# Altium schematic sheet 2_Microcontroller.SchDoc
size A4; SheetNumber: 2; SheetTotal: 4
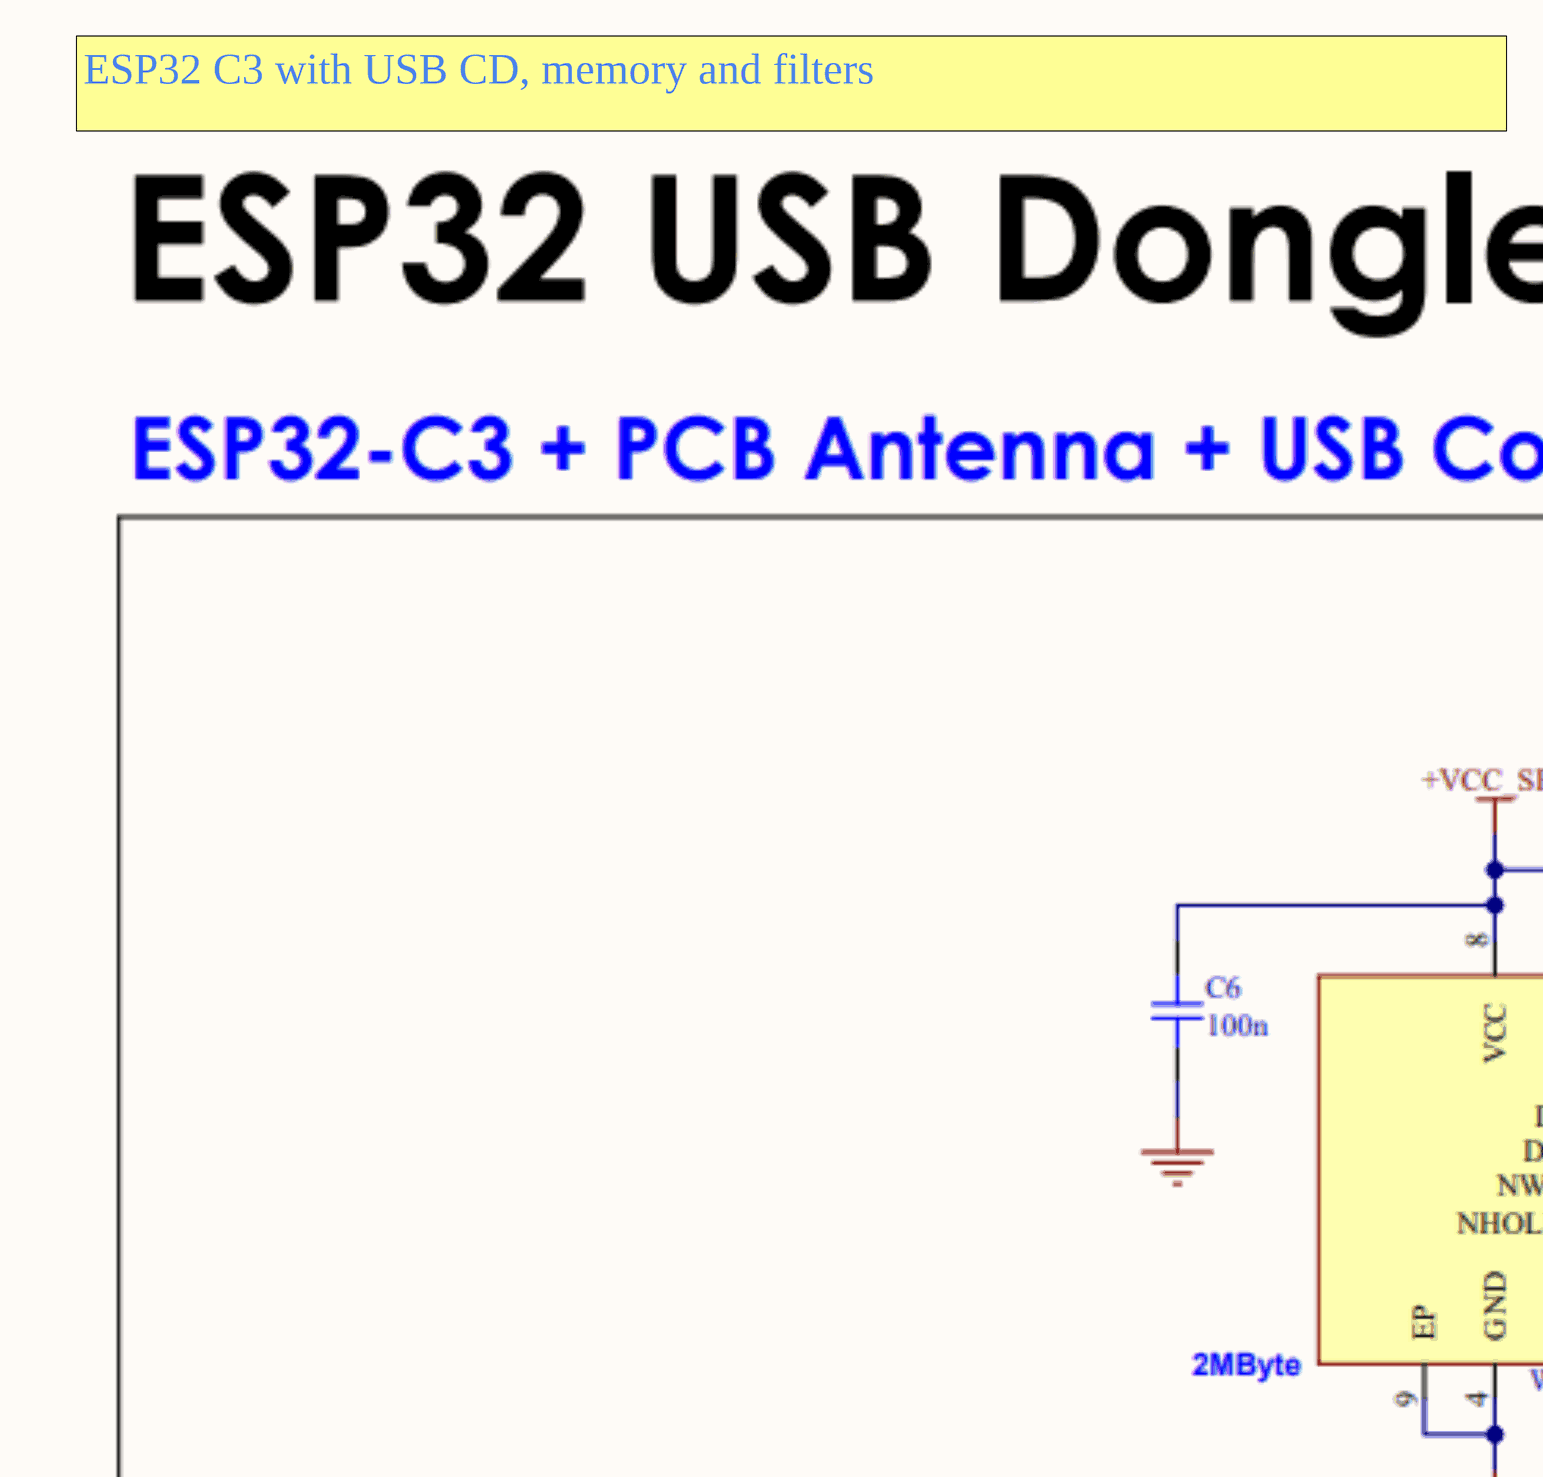
[diagram p0: 2_Microcontroller.SchDoc, top right]
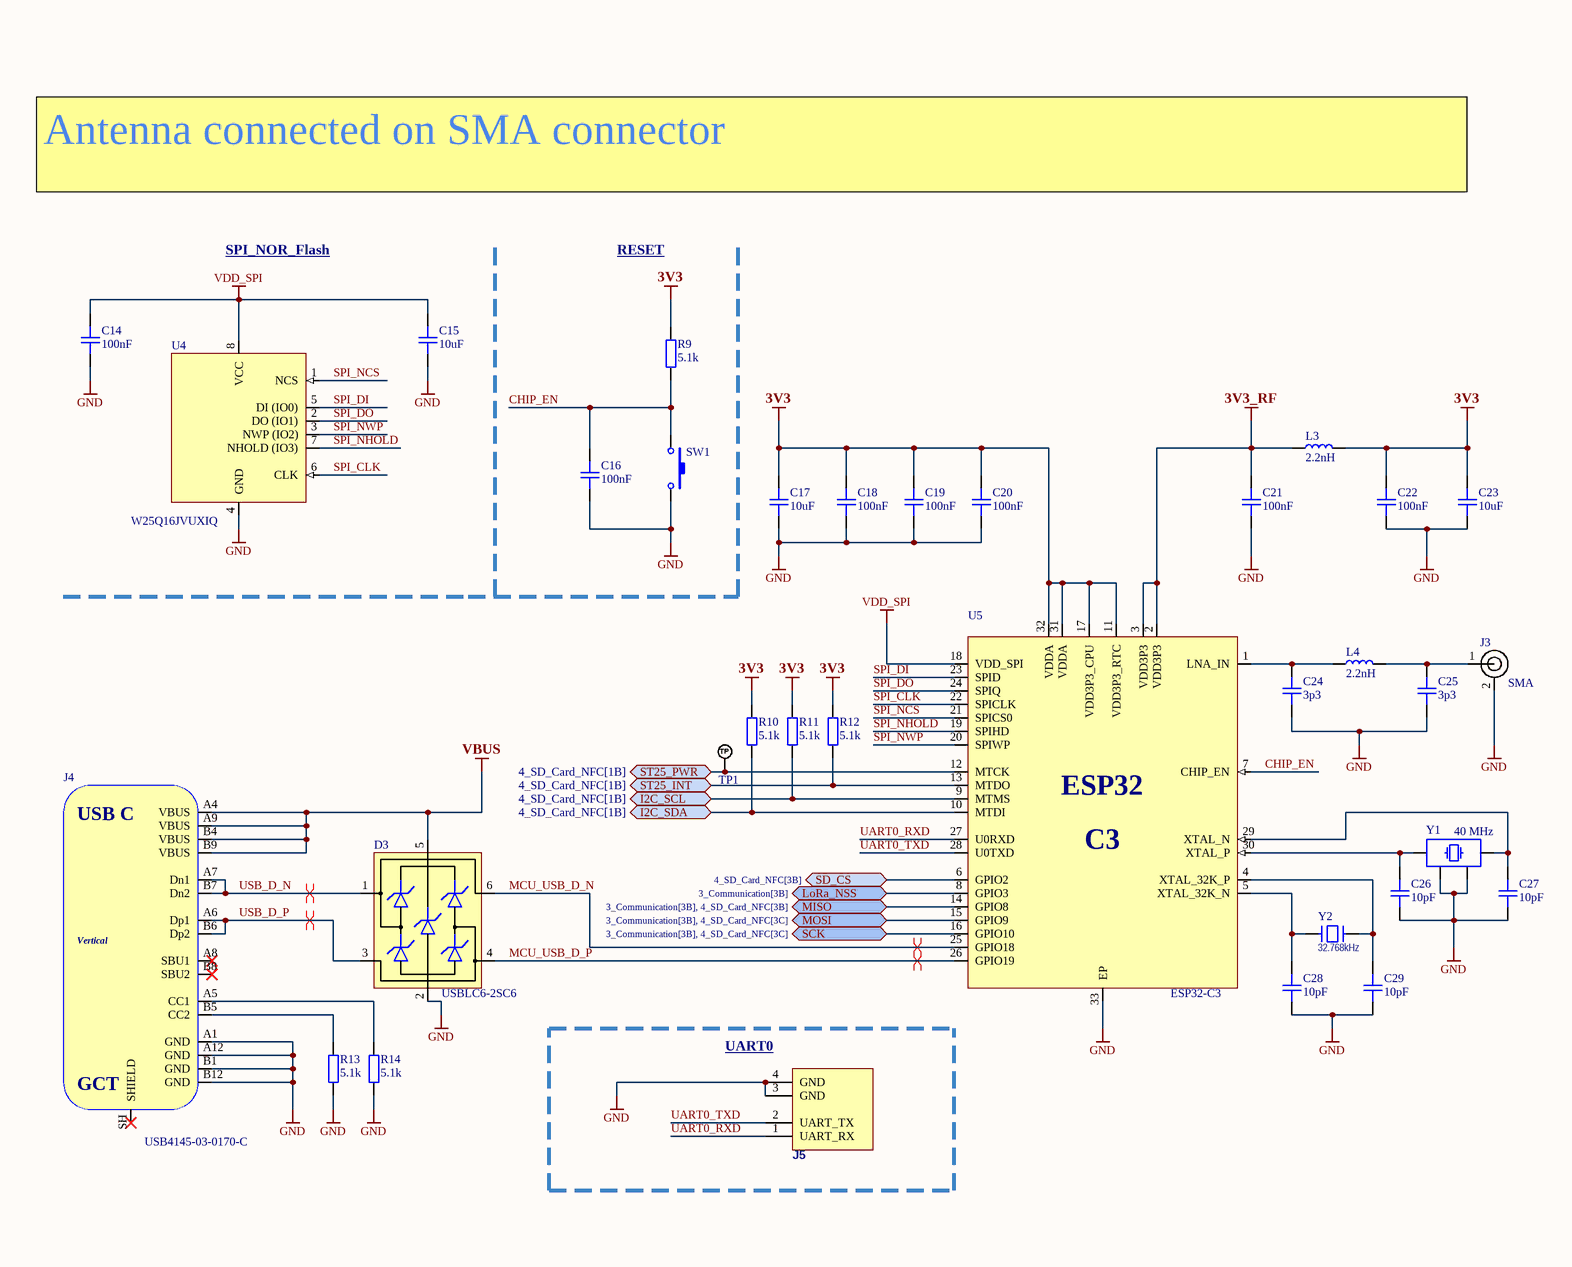
[diagram p1: 2_Microcontroller.SchDoc, bottom left]
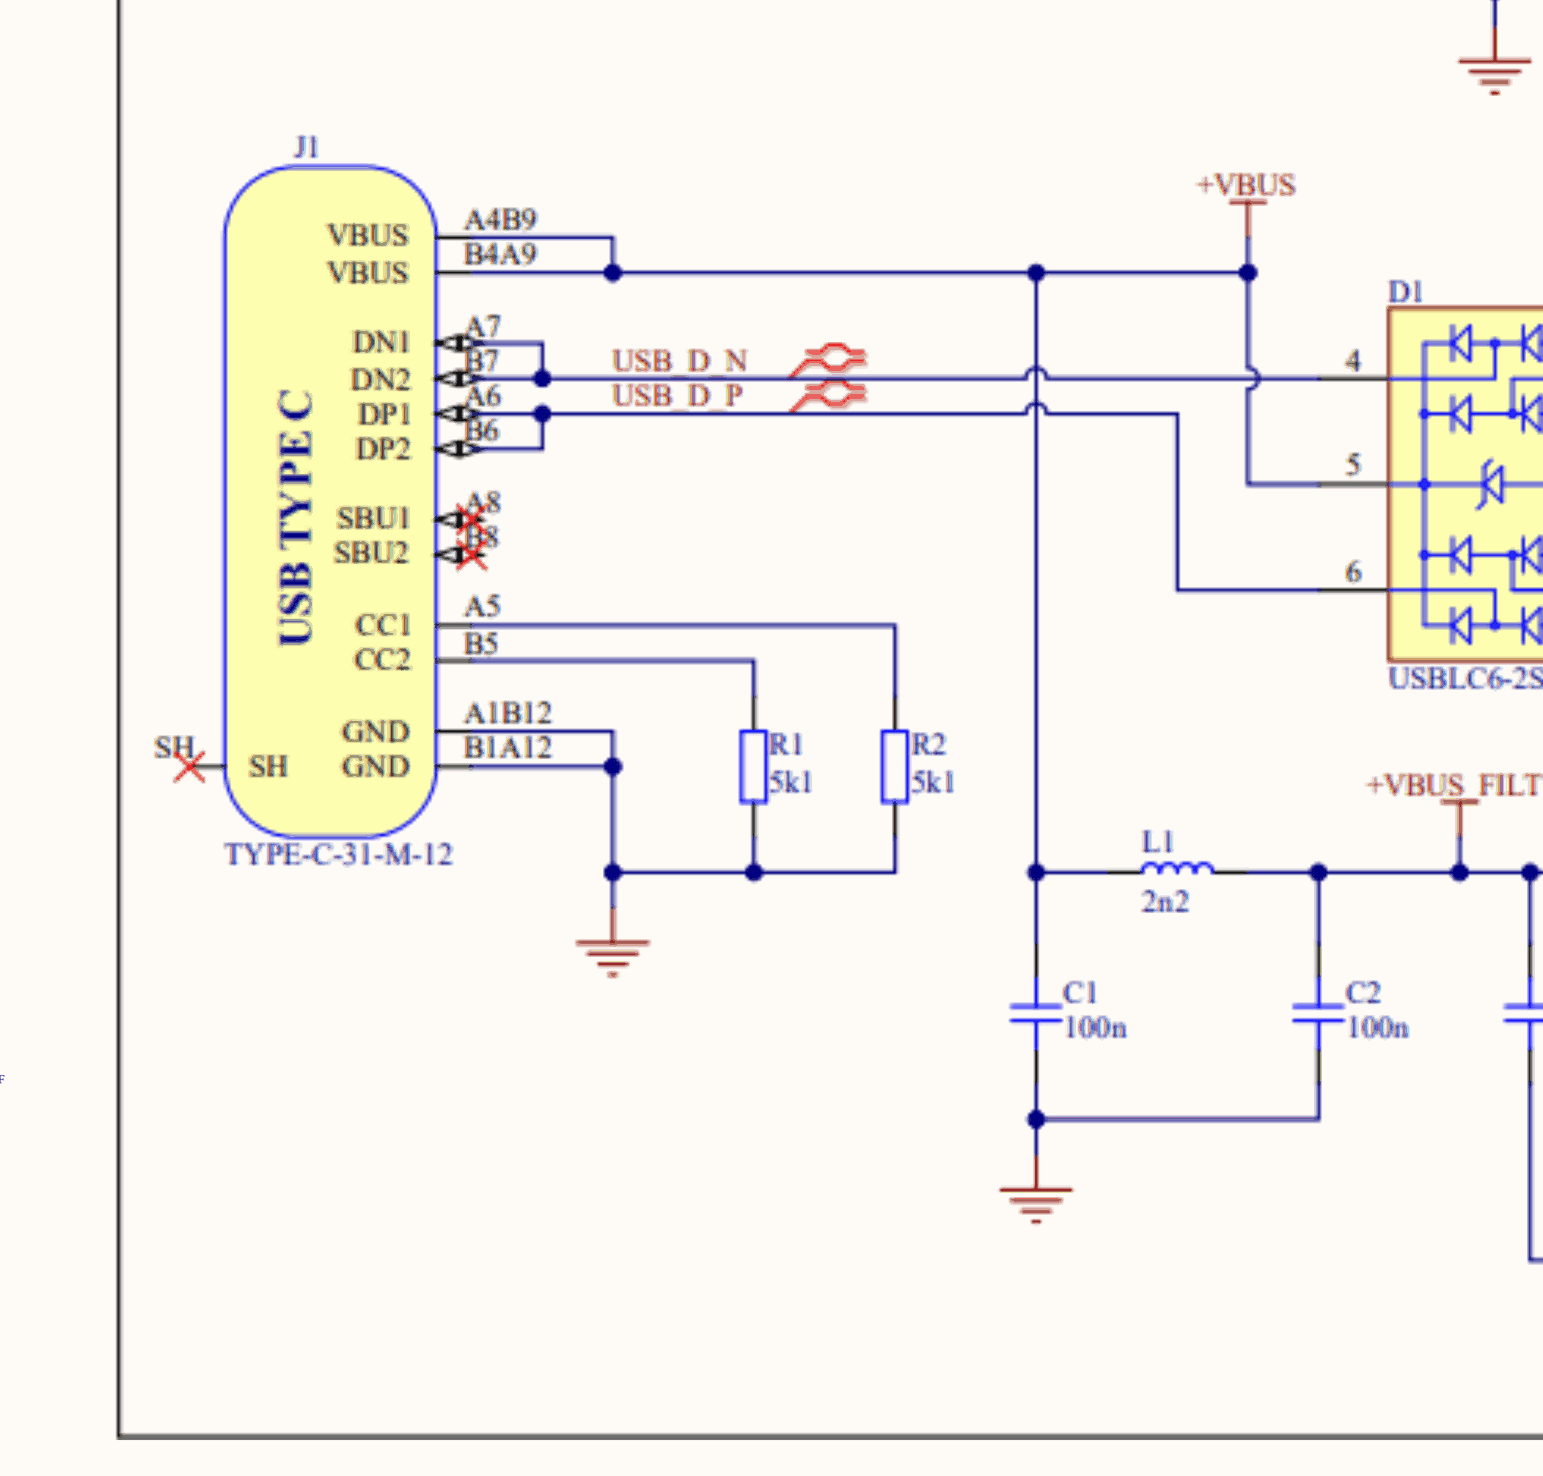
[diagram p2: 2_Microcontroller.SchDoc, bottom right]

## Parts
C14  100nF  [C0603]
C15  10uF  [C0805]
C16  100nF  [C0603]
C17  10uF  [C0805]
C18  100nF  [C0603]
C19  100nF  [C0603]
C20  100nF  [C0603]
C21  100nF  [C0603]
C22  100nF  [C0603]
C23  10uF  [C0805]
C24  3p3  [C0603]
C25  3p3  [C0603]
C26  10pF  [C0603]
C27  10pF  [C0603]
C28  10pF  [C0603]
C29  10pF  [C0603]
D3  USBLC6-2SC6  [SOT23-6]
J3  SMA  [CON_SMA-EDGE-S]
J4  USB4145-03-0170-C  [VALCON_CSP-USC16-TR]
J5  Header1x4  [HEADER_2x2_2.54]  (value not drawn)
L3  2.2nH  [L0603]
L4  2.2nH  [L0603]
R9  5.1k  [R0603]
R10  5.1k  [R0603]
R11  5.1k  [R0603]
R12  5.1k  [R0603]
R13  5.1k  [R0603]
R14  5.1k  [R0603]
SW1  PTS645SM43SMTR92 LFS  [SW_SKRPACE010]  (value not drawn)
TP1  TP_NOBOM  [TEST_PAD_THD]  (value not drawn)  (no BOM)
U4  W25Q16JVUXIQ  [SOIC-SN8_N]
U5  ESP32-C3  [QFN-32-5x5x0.85mm]
Y1  40 MHz  [CRYSTAL_ECX-32_3.2x2.5x0.8 - duplicate]
Y2  32.768kHz  [CRYSTAL_SX-3215]

## Blocks framed on the sheet
UART0: J5

## Ports
I2C_SCL (bidir, see 4_SD_Card_NFC[1B]), I2C_SDA (bidir, see 4_SD_Card_NFC[1B]), LoRa_NSS (bidir, see 3_Communication[3B]), MISO (bidir, see 3_Communication[3B], 4_SD_Card_NFC[3B]), MOSI (bidir, see 3_Communication[3B], 4_SD_Card_NFC[3C]), SCK (bidir, see 3_Communication[3B], 4_SD_Card_NFC[3C]), SD_CS (bidir, see 4_SD_Card_NFC[3B]), ST25_INT (bidir, see 4_SD_Card_NFC[1B]), ST25_PWR (bidir, see 4_SD_Card_NFC[1B])

## Nets
3V3: C17.2 C18.2 C19.2 C20.2 C22.2 C23.2 L3.2 R9.2 R10.2 R11.2 R12.2 U5.11(VDD3P3_RTC) U5.17(VDD3P3_CPU) U5.31(VDDA) U5.32(VDDA)
3V3_RF: C21.2 L3.1 U5.2(VDD3P3) U5.3(VDD3P3)
GND: C14.1 C15.1 C16.1 C17.1 C18.1 C19.1 C20.1 C21.1 C22.1 C23.1 C24.1 C25.1 C26.1 C27.1 C28.1 C29.1 D3.2(GND) J3.2 J4.A1(GND) J4.A12(GND) J4.B1(GND) J4.B12(GND) J5.3(GND) J5.4(GND) R13.1 R14.1 SW1.2 U4.4(GND) U5.33(EP) Y1.2 Y1.4
VBUS: D3.5(VBUS) J4.A4(VBUS) J4.A9(VBUS) J4.B4(VBUS) J4.B9(VBUS)
VDD_SPI: C14.2 C15.2 U4.8(VCC) U5.18(VDD_SPI)
CHIP_EN: C16.2 R9.1 SW1.1 U5.7(CHIP_EN)
I2C_SCL: R11.1 U5.9(MTMS) ; port I2C_SCL
I2C_SDA: R10.1 U5.10(MTDI) ; port I2C_SDA
LoRa_NSS: U5.8(GPIO3) ; port LoRa_NSS
MCU_USB_D_N: D3.6(IO1) U5.25(GPIO18)
MCU_USB_D_P: D3.4(IO2) U5.26(GPIO19)
MISO: U5.14(GPIO8) ; port MISO
MOSI: U5.15(GPIO9) ; port MOSI
SCK: U5.16(GPIO10) ; port SCK
SD_CS: U5.6(GPIO2) ; port SD_CS
SPI_CLK: U4.6(CLK) U5.22(SPICLK)
SPI_DI: U4.5(DI_(IO0)) U5.23(SPID)
SPI_DO: U4.2(DO_(IO1)) U5.24(SPIQ)
SPI_NCS: U4.1(NCS) U5.21(SPICS0)
SPI_NHOLD: U4.7(NHOLD_(IO3)) U5.19(SPIHD)
SPI_NWP: U4.3(NWP_(IO2)) U5.20(SPIWP)
ST25_INT: R12.1 U5.13(MTDO) ; port ST25_INT
ST25_PWR: TP1.1(TP) U5.12(MTCK) ; port ST25_PWR
UART0_RXD: J5.1(UART_RX) U5.27(U0RXD)
UART0_TXD: J5.2(UART_TX) U5.28(U0TXD)
USB_D_N: D3.1(IO1) J4.A7(Dn1) J4.B7(Dn2)
USB_D_P: D3.3(IO2) J4.A6(Dp1) J4.B6(Dp2)
NetC24_2: C24.2 L4.1 U5.1(LNA_IN)
NetC25_2: C25.2 J3.1 L4.2
NetC26_2: C26.2 U5.30(XTAL_P) Y1.1
NetC27_2: C27.2 U5.29(XTAL_N) Y1.3
NetC28_2: C28.2 U5.5(XTAL_32K_N) Y2.2
NetC29_2: C29.2 U5.4(XTAL_32K_P) Y2.1
NetJ4_A5: J4.A5(CC1) R14.2
NetJ4_B5: J4.B5(CC2) R13.2

Not connected (* = marked no-connect by the designer): J4 A8(SBU1)* B8(SBU2)* SH(SHIELD)*

## Layout directives
differential pair: MCU_USB_D_N, MCU_USB_D_P, USB_D_N, USB_D_P

## Notes on the sheet
- ESP32 C3 with USB CD, memory and filters
- Antenna connected on SMA connector
- SPI_NOR_Flash
- RESET
- (in symbol ESP32-C3) ESP32; C3
- (in symbol USB4145-03-0170-C) USB C; Vertical

## Library data of the parts
C14 C16 C18-C22 C24-C29 = CAP_0603: Capacitor SMD 0603; Manufacturer: *; Manufacturer Part Number: *; Distributor Link: *; LCSC: *; Rating: *; Dielectric: *
C15 C17 C23 = CAP_0805: Capacitor SMD 0805; Manufacturer: *; Manufacturer Part Number: *; Distributor Link: *; LCSC: *; Rating: *; Dielectric: *
D3 = USBLC6-2SC6: Low-Capacitance ESD Protection USB; Manufacturer: STMicroelectronics; Manufacturer Part Number: USBLC6-2SC6; Distributor Link: https://www.mouser.de/ProductDetail/STMicroelectronics/USBLC6-2SC6?qs=po45yt2pPpu%2FhNIlwQdTlg%3D%3D
J3 = CON-SMA-EDGE-S: RF Connector SMA Female 50 Ohms 18 GHz PCB Edge Mount; Manufacturer: RF Solutions; Manufacturer Part Number: CON-SMA-EDGE-S
J4 = USB4145-03-0170-C: USB Connector Type C SMT 16 Pin Vertical; Manufacturer: GCT; Manufacturer Part Number: USB4145-03-0170-C
J5 = Header1x4: *; PackageReference: *; Manufacturer Part Number 1: *
L3 L4 = IND_1008: Inductor SMD 1008
R9-R14 = RES_0603: Resistor SMD 0603; Manufacturer: *; Manufacturer Part Number: *; Distributor Link: *; LCSC: *
SW1 = SW-PB: Switch; Published: 24-Mar-1999; LatestRevisionDate: 17-Jul-2002; LatestRevisionNote: Re-released for DXP Platform.; Publisher: Altium Limited; PackageDescription: Switch; 2 Leads; Manufacturer Part Number 1: PTS645SM43SMTR92 LFS; PackageReference: SW-PB
TP1 = TEST_POINT_RND_1MM: Test Point Round 1mm (NO BOM)
U4 = W25Q16JVUXIQ: 16M-BIT SERIAL FLASH MEMORY WITH DUAL/QUAD SPI USON-8; Manufacturer: Winbond; Manufacturer Part Number: W25Q16JVUXIQ; LCSC: C2843335
U5 = ESP32-C3: Ultra­Low­Power SoC with RISC­V Single­Core CPU Supporting IEEE 802.11b/g/n (2.4 GHz Wi­Fi) and Bluetooth® 5 (LE); Manufacturer: Espressif; Manufacturer Part Number: ESP32-C3; LCSC: C2838500
Y1 = XTAL_2016: Crystal SMD 4-Pin 3225x4; Distributor Link: *
Y2 = CRYSTAL_1: Crystal; Manufacturer Part Number 1: *; PackageReference: SX-3215